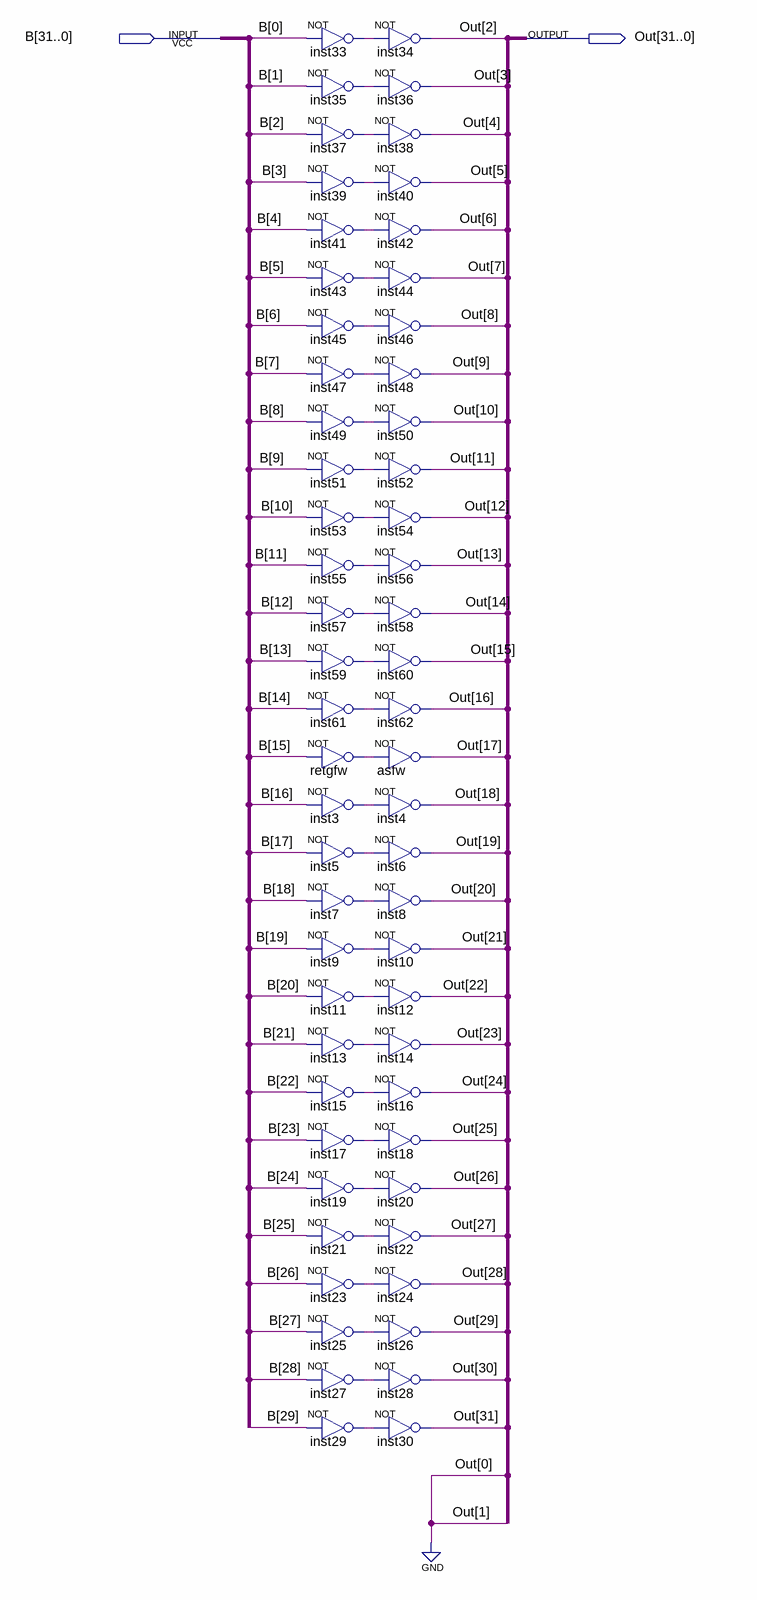
[diagram p0: schematic sheet]
// Quartus schematic Deslocamento2Esquerda.bdf as structural Verilog: 60 symbols, 2 pins
module Deslocamento2Esquerda (
  input  [31:0] B,
  output [31:0] Out
);

  wire inst3_out, inst5_out, inst7_out, inst9_out, inst11_out, inst13_out, inst15_out, inst17_out,
       inst19_out, inst21_out, inst23_out, inst25_out, inst27_out, inst29_out, inst33_out, inst35_out,
       inst37_out, inst39_out, inst41_out, inst43_out, inst45_out, inst47_out, inst49_out, inst51_out,
       inst53_out, inst55_out, inst57_out, inst59_out, inst61_out, retgfw_out;

  not inst33 (inst33_out, B[0]);
  not inst35 (inst35_out, B[1]);
  not inst37 (inst37_out, B[2]);
  not inst39 (inst39_out, B[3]);
  not inst41 (inst41_out, B[4]);
  not inst43 (inst43_out, B[5]);
  not inst45 (inst45_out, B[6]);
  not inst47 (inst47_out, B[7]);
  not inst49 (inst49_out, B[8]);
  not inst51 (inst51_out, B[9]);
  not inst53 (inst53_out, B[10]);
  not inst55 (inst55_out, B[11]);
  not inst57 (inst57_out, B[12]);
  not inst59 (inst59_out, B[13]);
  not inst61 (inst61_out, B[14]);
  not retgfw (retgfw_out, B[15]);
  not inst3 (inst3_out, B[16]);
  not inst5 (inst5_out, B[17]);
  not inst7 (inst7_out, B[18]);
  not inst9 (inst9_out, B[19]);
  not inst11 (inst11_out, B[20]);
  not inst13 (inst13_out, B[21]);
  not inst15 (inst15_out, B[22]);
  not inst17 (inst17_out, B[23]);
  not inst19 (inst19_out, B[24]);
  not inst21 (inst21_out, B[25]);
  not inst23 (inst23_out, B[26]);
  not inst25 (inst25_out, B[27]);
  not inst27 (inst27_out, B[28]);
  not inst29 (inst29_out, B[29]);
  not inst34 (Out[2], inst33_out);
  not inst36 (Out[3], inst35_out);
  not inst38 (Out[4], inst37_out);
  not inst40 (Out[5], inst39_out);
  not inst42 (Out[6], inst41_out);
  not inst44 (Out[7], inst43_out);
  not inst46 (Out[8], inst45_out);
  not inst48 (Out[9], inst47_out);
  not inst50 (Out[10], inst49_out);
  not inst52 (Out[11], inst51_out);
  not inst54 (Out[12], inst53_out);
  not inst56 (Out[13], inst55_out);
  not inst58 (Out[14], inst57_out);
  not inst60 (Out[15], inst59_out);
  not inst62 (Out[16], inst61_out);
  not asfw (Out[17], retgfw_out);
  not inst4 (Out[18], inst3_out);
  not inst6 (Out[19], inst5_out);
  not inst8 (Out[20], inst7_out);
  not inst10 (Out[21], inst9_out);
  not inst12 (Out[22], inst11_out);
  not inst14 (Out[23], inst13_out);
  not inst16 (Out[24], inst15_out);
  not inst18 (Out[25], inst17_out);
  not inst20 (Out[26], inst19_out);
  not inst22 (Out[27], inst21_out);
  not inst24 (Out[28], inst23_out);
  not inst26 (Out[29], inst25_out);
  not inst28 (Out[30], inst27_out);
  not inst30 (Out[31], inst29_out);

  assign Out[1:0] = 2'b00;
endmodule
